# EAGLE design waga_can (EAGLE 7.7.0)

## Sheet 1 of 2
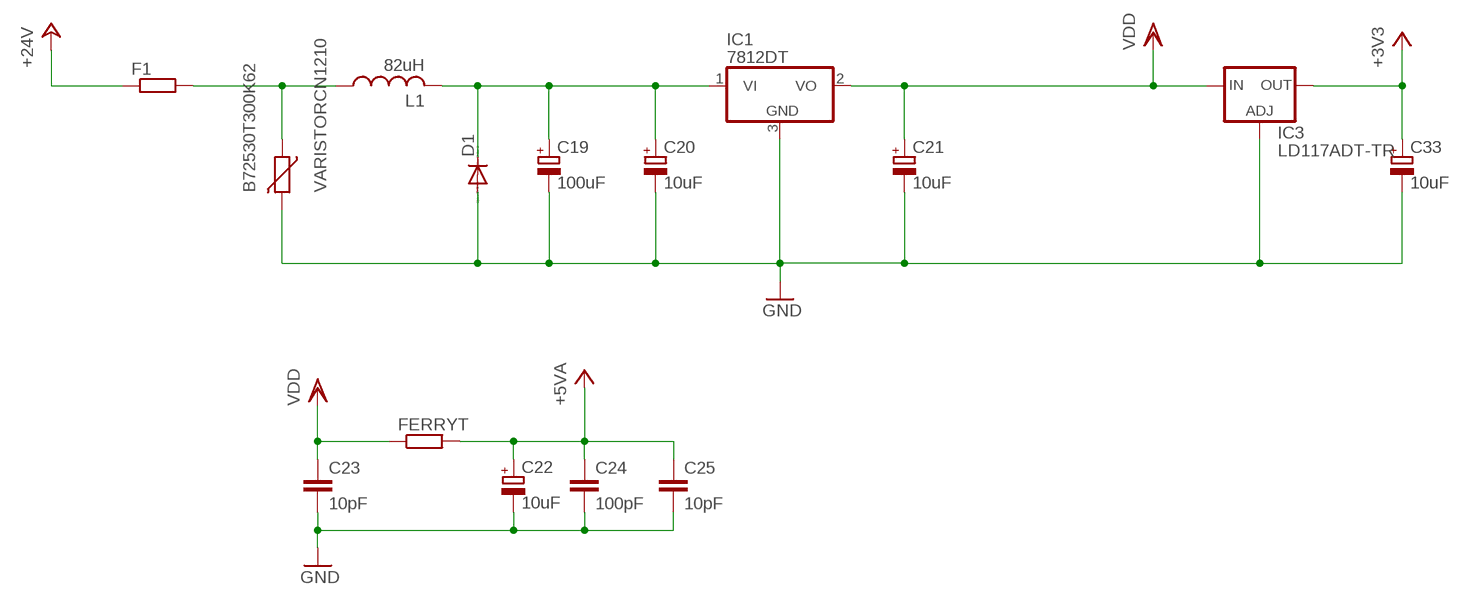
[diagram p0: schematic, sheet 1]

### Parts
B72530T300K62  VARISTORCN1210  [CT/CN1210]
C19  100uF  CPOL-EU153CLV-0810  [153CLV-0810]
C20  10uF  CPOL-EU153CLV-0605  [153CLV-0605]
C21  10uF  CPOL-EU153CLV-0605  [153CLV-0605]
C22  10uF  CPOL-EU153CLV-0605  [153CLV-0605]
C23  10pF  C-EUC0805  [C0805]
C24  100pF  C-EUC0805  [C0805]
C25  10pF  C-EUC0805  [C0805]
C33  10uF  CPOL-EU153CLV-0605  [153CLV-0605]
D1  DIODE-SMB  [SMB]
F1  R-EU_1812X7R  [1812X7R]
FERRYT  R-EU_M0805  [M0805]
IC1  7812DT  [TO252]
IC3  LD117ADT-TR  [DPACK]
L1  82uH  L-USL4532P  [L4532P]

### Nets
+3V3: C33.+ IC3.4(OUT) ; also sheet 2
+5V: C22.+ C24.1 C25.1 FERRYT.2 ; supply symbol labelled +5VA ; also sheet 2
+24V: F1.1 ; also sheet 2
GND: B72530T300K62.2 C19.- C20.- C21.- C22.- C23.2 C24.2 C25.2 C33.- D1.A IC1.3(GND) IC3.1(ADJ) ; also sheet 2
N$1: C19.+ C20.+ D1.C IC1.1(VI) L1.2
N$2: B72530T300K62.1 F1.2 L1.1
VDD: C21.+ C23.1 FERRYT.1 IC1.2(VO) IC3.3(IN)

## Sheet 2 of 2
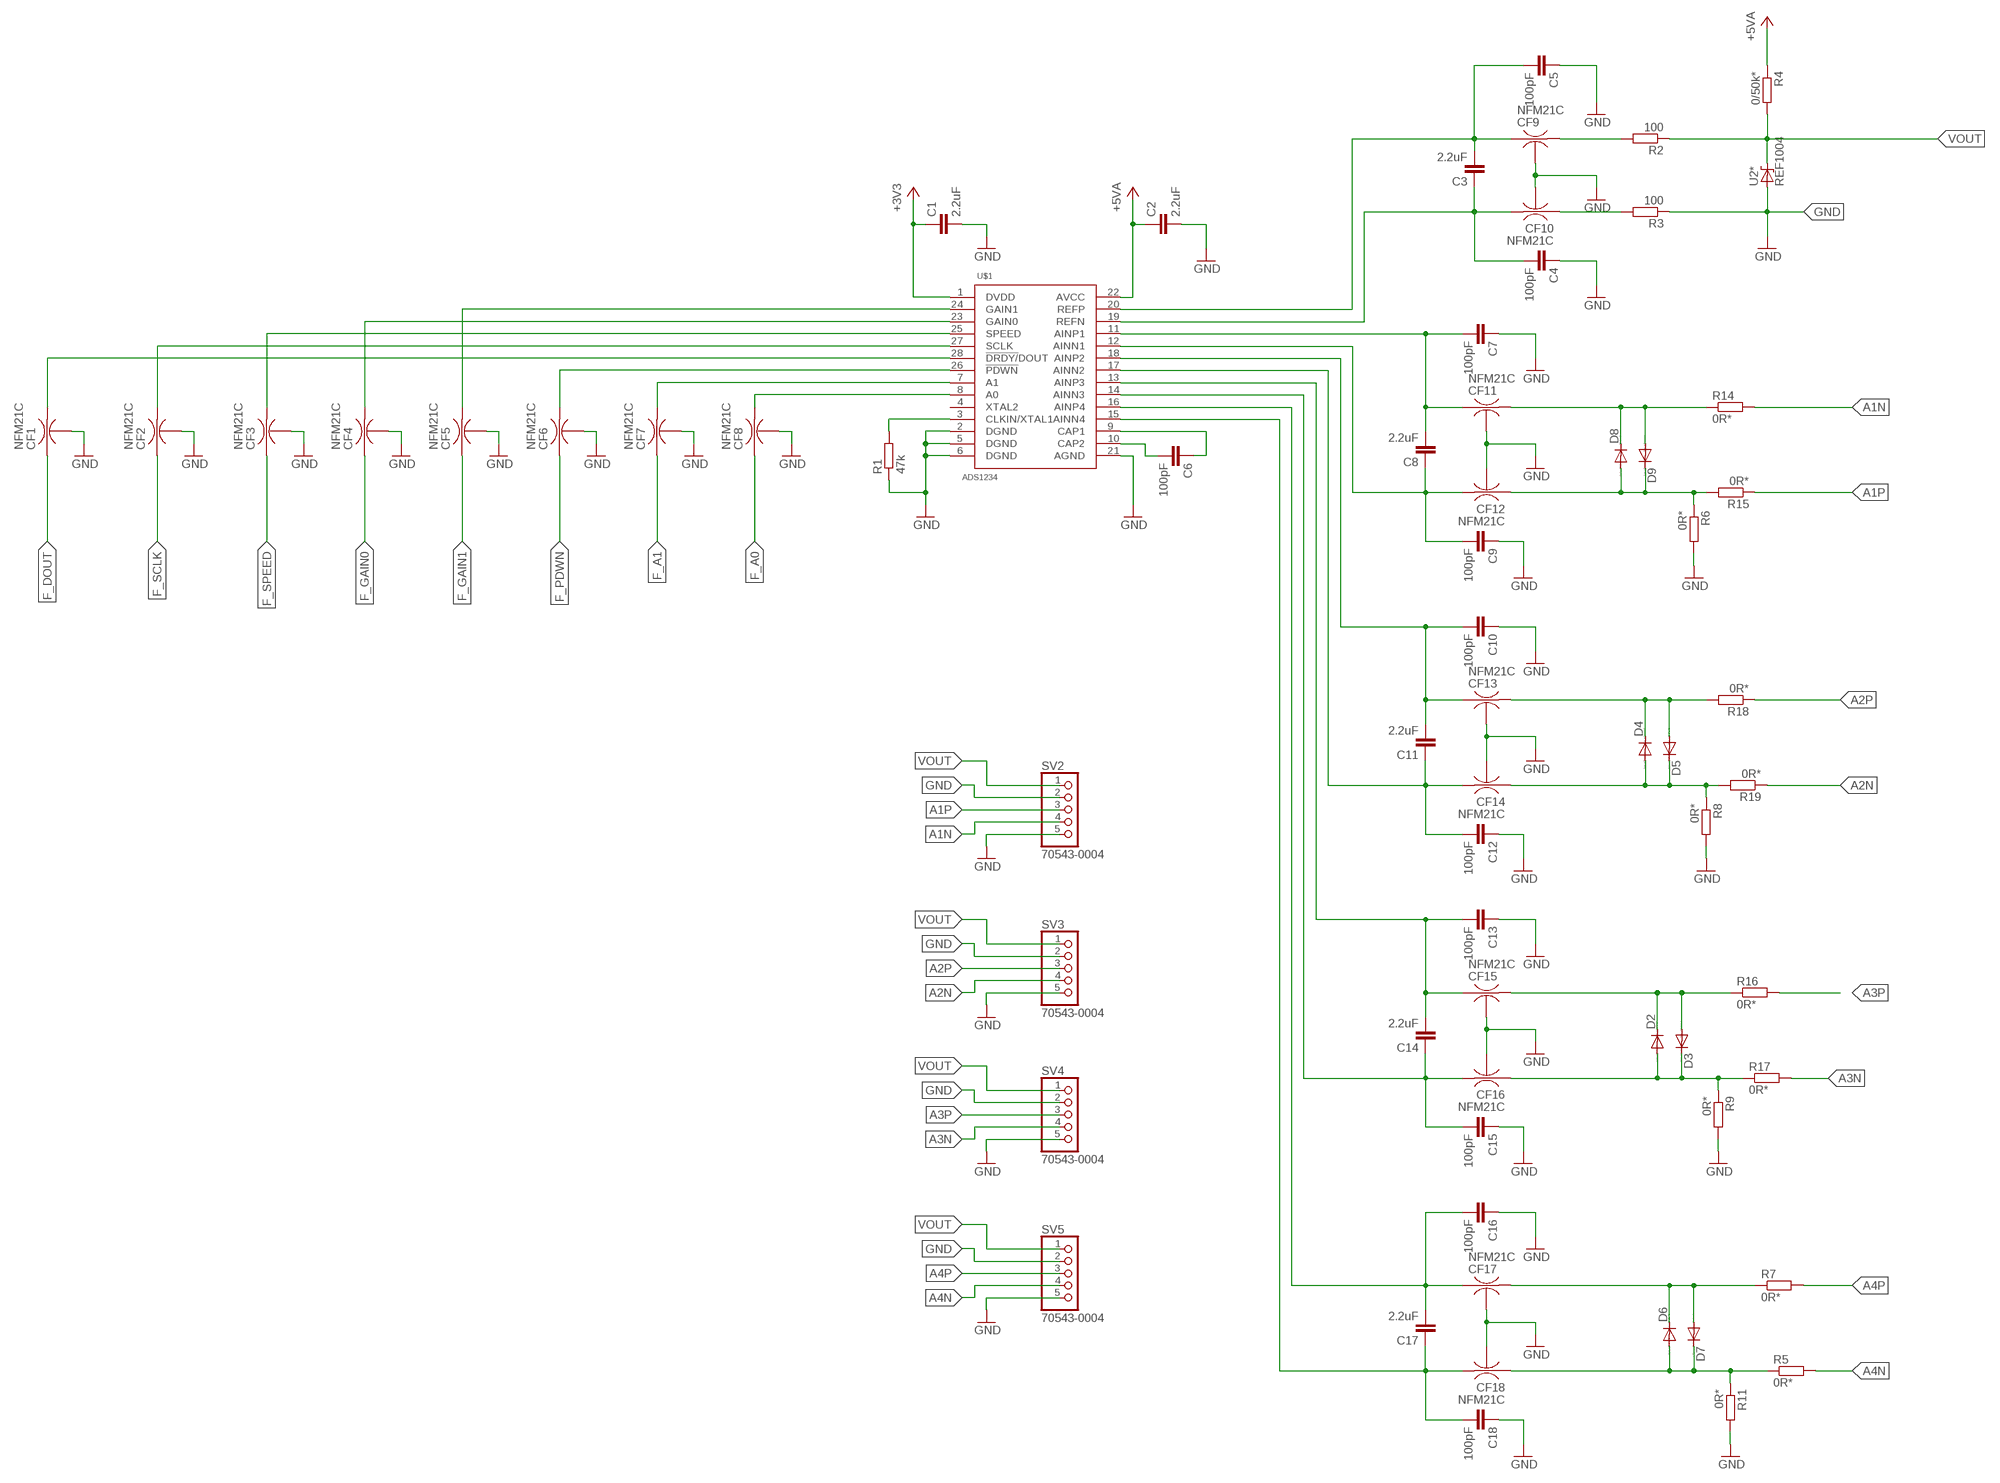
[diagram p1: schematic, sheet 2, part 1 of 2]
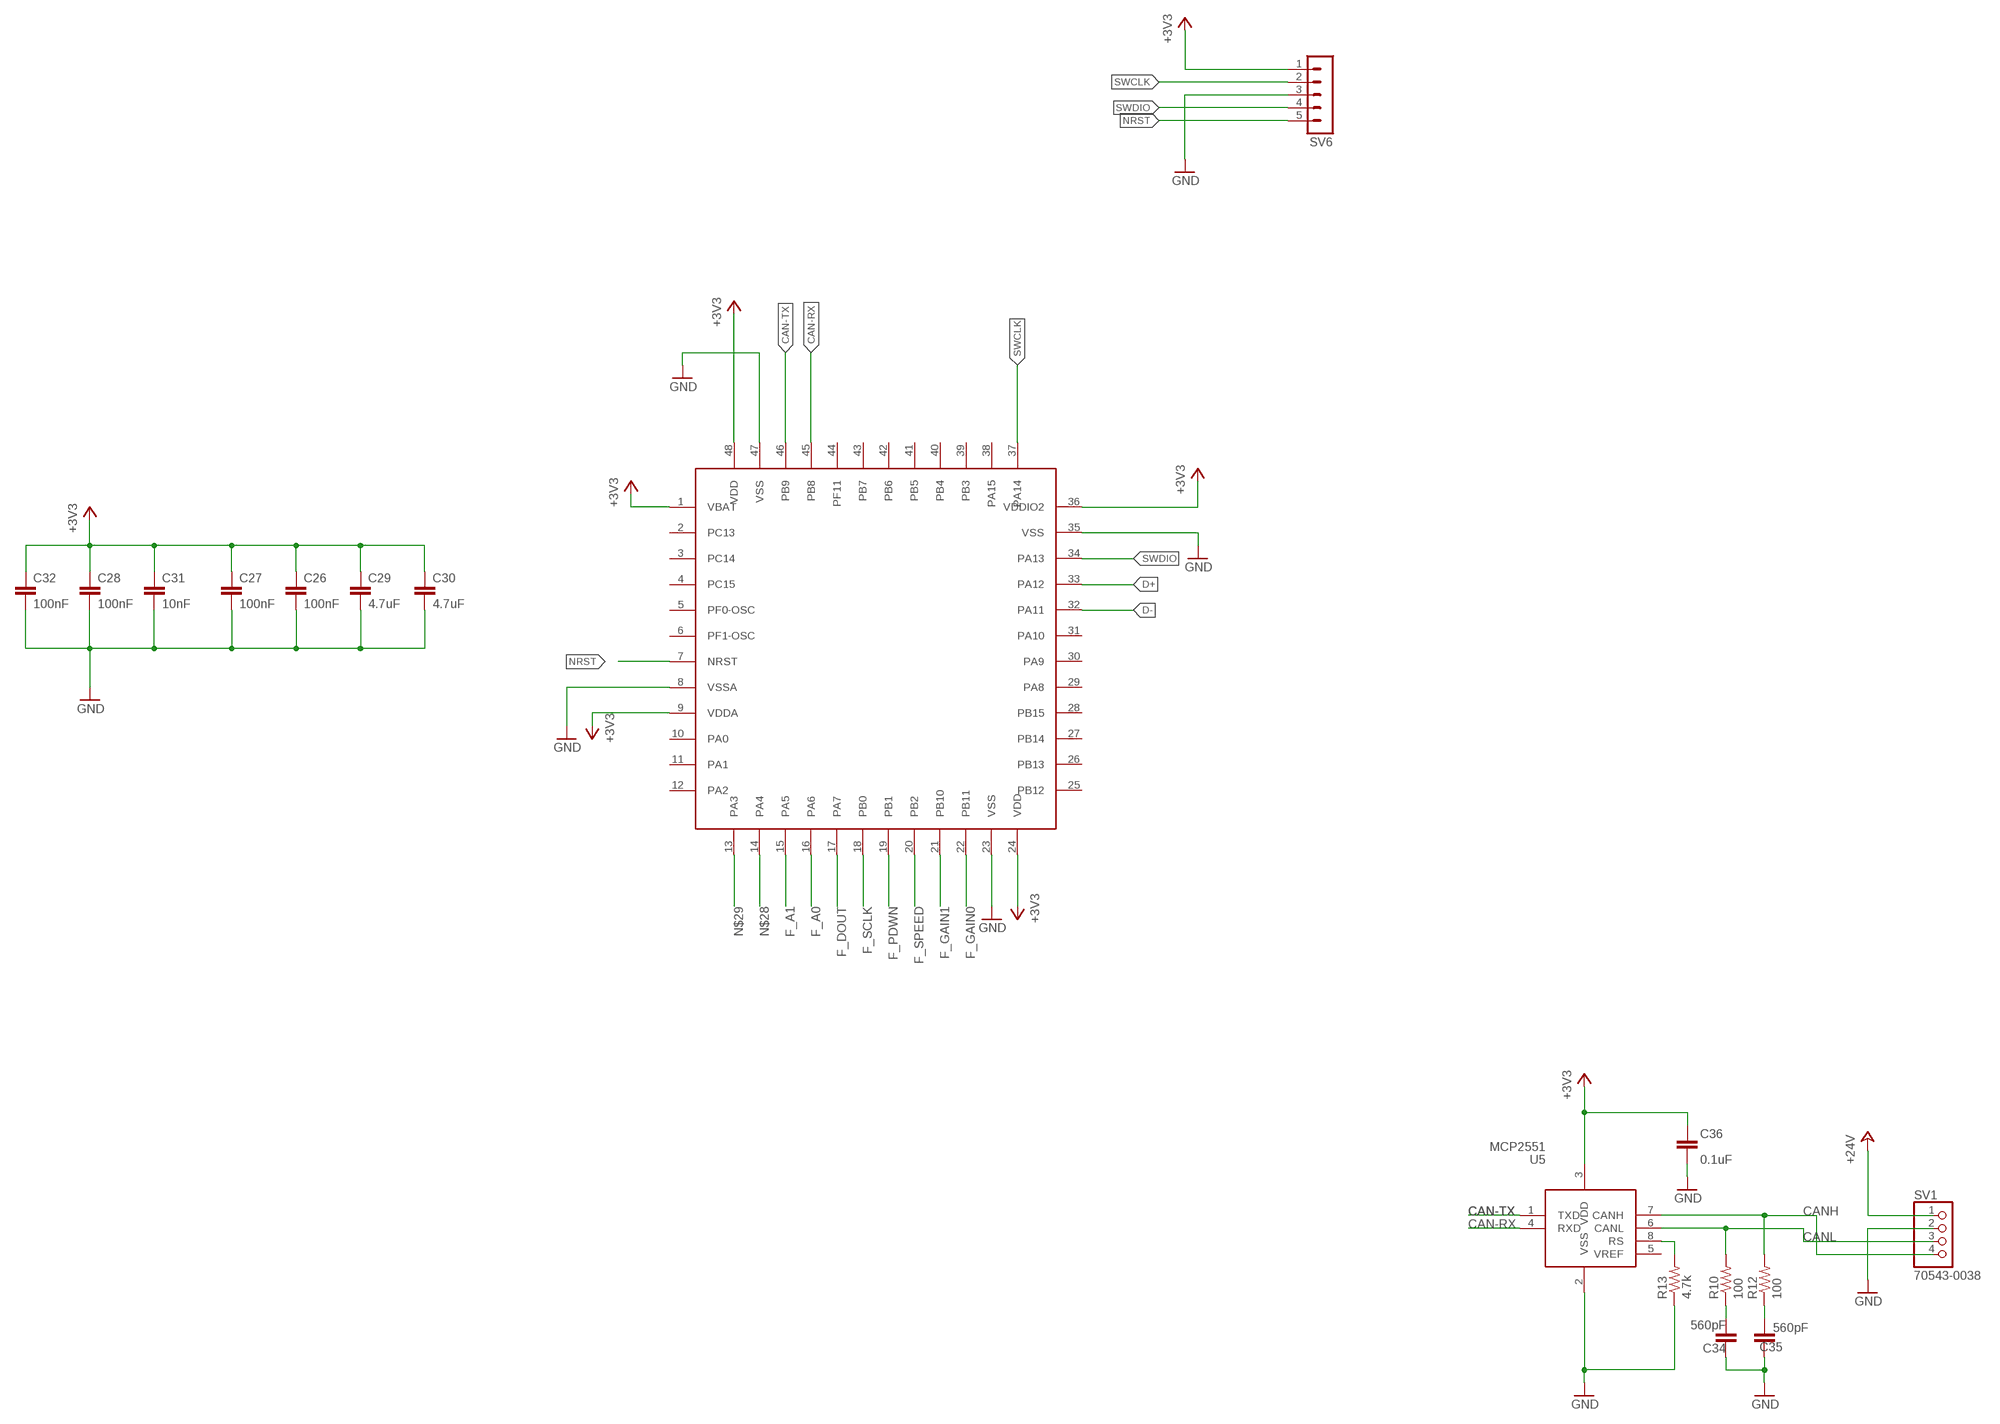
[diagram p2: schematic, sheet 2, part 2 of 2]

### Parts
C1  2.2uF  C-EUC0805K  [C0805K]
C2  2.2uF  C-EUC0805K  [C0805K]
C3  2.2uF  C-EUC0805K  [C0805K]
C4  100pF  C-EUC0805K  [C0805K]
C5  100pF  C-EUC0805K  [C0805K]
C6  100pF  C-EUC0805K  [C0805K]
C7  100pF  C-EUC0805K  [C0805K]
C8  2.2uF  C-EUC0805K  [C0805K]
C9  100pF  C-EUC0805K  [C0805K]
C10  100pF  C-EUC0805K  [C0805K]
C11  2.2uF  C-EUC0805K  [C0805K]
C12  100pF  C-EUC0805K  [C0805K]
C13  100pF  C-EUC0805K  [C0805K]
C14  2.2uF  C-EUC0805K  [C0805K]
C15  100pF  C-EUC0805K  [C0805K]
C16  100pF  C-EUC0805K  [C0805K]
C17  2.2uF  C-EUC0805K  [C0805K]
C18  100pF  C-EUC0805K  [C0805K]
C26  100nF  C-EUC0603  [C0603]
C27  100nF  C-EUC0603  [C0603]
C28  100nF  C-EUC0603  [C0603]
C29  4.7uF  C-EUC0603  [C0603]
C30  4.7uF  C-EUC0603  [C0603]
C31  10nF  C-EUC0603  [C0603]
C32  100nF  C-EUC0603  [C0603]
C34  560pF  CAP0603-CAP  [0603-CAP]
C35  560pF  CAP0603-CAP  [0603-CAP]
C36  0.1uF  CAP0603-CAP  [0603-CAP]
CF1  NFM21C  [NFM21C]
CF2  NFM21C  [NFM21C]
CF3  NFM21C  [NFM21C]
CF4  NFM21C  [NFM21C]
CF5  NFM21C  [NFM21C]
CF6  NFM21C  [NFM21C]
CF7  NFM21C  [NFM21C]
CF8  NFM21C  [NFM21C]
CF9  NFM21C  [NFM21C]
CF10  NFM21C  [NFM21C]
CF11  NFM21C  [NFM21C]
CF12  NFM21C  [NFM21C]
CF13  NFM21C  [NFM21C]
CF14  NFM21C  [NFM21C]
CF15  NFM21C  [NFM21C]
CF16  NFM21C  [NFM21C]
CF17  NFM21C  [NFM21C]
CF18  NFM21C  [NFM21C]
D2  DIODE-MICROMELF-W  [MICROMELF-W]
D3  DIODE-MICROMELF-W  [MICROMELF-W]
D4  DIODE-MICROMELF-W  [MICROMELF-W]
D5  DIODE-MICROMELF-W  [MICROMELF-W]
D6  DIODE-MICROMELF-W  [MICROMELF-W]
D7  DIODE-MICROMELF-W  [MICROMELF-W]
D8  DIODE-MICROMELF-W  [MICROMELF-W]
D9  DIODE-MICROMELF-W  [MICROMELF-W]
R1  47k  R-EU_R0805  [R0805]
R2  100  R-EU_R0805  [R0805]
R3  100  R-EU_R0805  [R0805]
R4  0/50k*  R-EU_R0805  [R0805]
R5  0R*  R-EU_R0603  [R0603]
R6  0R*  R-EU_R0603  [R0603]
R7  0R*  R-EU_R0603  [R0603]
R8  0R*  R-EU_R0603  [R0603]
R9  0R*  R-EU_R0603  [R0603]
R10  100  RESISTOR0603-RES  [0603-RES]
R11  0R*  R-EU_R0603  [R0603]
R12  100  RESISTOR0603-RES  [0603-RES]
R13  4.7k  RESISTOR0603-RES  [0603-RES]
R14  0R*  R-EU_R0603  [R0603]
R15  0R*  R-EU_R0603  [R0603]
R16  0R*  R-EU_R0603  [R0603]
R17  0R*  R-EU_R0603  [R0603]
R18  0R*  R-EU_R0603  [R0603]
R19  0R*  R-EU_R0603  [R0603]
SV1  70543-0038  [70543-0038]
SV2  70543-0004  [70543-0004]
SV3  70543-0004  [70543-0004]
SV4  70543-0004  [70543-0004]
SV5  70543-0004  [70543-0004]
SV6  MA05-1  [MA05-1]
U2*  REF1004  [SO8]
U5  MCP2551  [SO-08M]
U$1  ADS1234  [TSSOP-28]
U$2  STM32F42C6T6  [LQFP48]

### Nets
+3V3: C1.1 C26.1 C27.1 C28.1 C29.1 C30.1 C31.1 C32.1 C36.2 SV6.1 U5.3(VDD) U$1.1(DVDD) U$2.1(VBAT) U$2.9(VDDA) U$2.24(VDD) U$2.36(VDDIO2) U$2.48(VDD) ; also sheet 1
+5V: C2.1 R4.1 U$1.22(AVCC) ; supply symbol labelled +5VA ; also sheet 1
+24V: SV1.1 ; also sheet 1
A0: CF8.3 U$1.8(A0)
A1: CF6.3 U$1.26(!PDWN)
A1N: R14.2 SV2.4
A1P: R15.1 SV2.3
A2N: R19.1 SV3.4
A2P: R18.1 SV3.3
A3N: R17.2 SV4.4
A3P: R16.2 SV4.3
A4N: R5.2 SV5.4
A4P: R7.2 SV5.3
CAN-RX: U5.4(RXD) U$2.45(PB8)
CAN-TX: U5.1(TXD) U$2.46(PB9)
CANH: R12.2 SV1.4 U5.7(CANH)
CANL: R10.2 SV1.3 U5.6(CANL)
D+: U$2.33(PA12)
D-: U$2.32(PA11)
DOUT: CF1.3 U$1.28(!DRDY/!DOUT)
F_A0: CF8.1 U$2.16(PA6)
F_A1: CF7.1 U$2.15(PA5)
F_DOUT: CF1.1 U$2.17(PA7)
F_GAIN0: CF4.1 U$2.22(PB11)
F_GAIN1: CF5.1 U$2.21(PB10)
F_PDWN: CF6.1 U$2.19(PB1)
F_SCLK: CF2.1 U$2.18(PB0)
F_SPEED: CF3.1 U$2.20(PB2)
GAIN0: CF4.3 U$1.23(GAIN0)
GAIN1: CF5.3 U$1.24(GAIN1)
GND: C1.2 C2.2 C4.1 C5.1 C7.1 C9.1 C10.1 C12.1 C13.1 C15.1 C16.1 C18.1 C26.2 C27.2 C28.2 C29.2 C30.2 C31.2 C32.2 C34.1 C35.1 C36.1 CF1.2@1 CF1.2@2 CF2.2@1 CF2.2@2 CF3.2@1 CF3.2@2 CF4.2@1 CF4.2@2 CF5.2@1 CF5.2@2 CF6.2@1 CF6.2@2 CF7.2@1 CF7.2@2 CF8.2@1 CF8.2@2 CF9.2@1 CF9.2@2 CF10.2@1 CF10.2@2 CF11.2@1 CF11.2@2 CF12.2@1 CF12.2@2 CF13.2@1 CF13.2@2 CF14.2@1 CF14.2@2 CF15.2@1 CF15.2@2 CF16.2@1 CF16.2@2 CF17.2@1 CF17.2@2 CF18.2@1 CF18.2@2 R1.1 R3.1 R6.2 R8.2 R9.2 R11.2 R13.1 SV1.2 SV2.2 SV2.5 SV3.2 SV3.5 SV4.2 SV4.5 SV5.2 SV5.5 SV6.3 U2*.4(A) U5.2(VSS) U$1.2(DGND) U$1.5(DGND) U$1.6(DGND) U$1.21(AGND) U$2.8(VSSA) U$2.23(VSS) U$2.35(VSS) U$2.47(VSS) ; also sheet 1
N$3: CF15.3 D2.C D3.A R16.1
N$4: CF16.1 D2.A D3.C R9.1 R17.1
N$5: C34.2 R10.1
N$7: CF7.3 U$1.7(A1)
N$9: R1.2 U$1.3(CLKIN/XTAL1)
N$10: CF18.1 D6.A D7.C R5.1 R11.1
N$11: C3.2 C5.2 CF9.1 U$1.20(REFP)
N$12: C3.1 C4.2 CF10.3 U$1.19(REFN)
N$13: CF17.3 D6.C D7.A R7.1
N$14: C14.1 C15.2 CF16.3 U$1.14(AINN3)
N$15: CF9.3 R2.2
N$16: CF10.1 R3.2
N$17: C6.2 U$1.10(CAP2)
N$18: C6.1 U$1.9(CAP1)
N$19: C35.2 R12.1
N$21: C7.2 C8.2 CF11.1 U$1.11(AINP1)
N$22: C8.1 C9.2 CF12.3 U$1.12(AINN1)
N$23: C10.2 C11.2 CF13.1 U$1.18(AINP2)
N$24: C11.1 C12.2 CF14.3 U$1.17(AINN2)
N$25: R13.2 U5.8(RS)
N$27: C13.2 C14.2 CF15.1 U$1.13(AINP3)
N$28: U$2.14(PA4)
N$29: U$2.13(PA3)
N$30: CF14.1 D4.A D5.C R8.1 R19.2
N$31: CF13.3 D4.C D5.A R18.2
N$32: CF11.3 D8.C D9.A R14.1
N$33: CF12.1 D8.A D9.C R6.1 R15.2
N$35: C16.2 C17.2 CF17.1 U$1.16(AINP4)
N$37: C17.1 C18.2 CF18.3 U$1.15(AINN4)
NRST: SV6.5 U$2.7(NRST)
SCLK: CF2.3 U$1.27(SCLK)
SPEED: CF3.3 U$1.25(SPEED)
SWCLK: SV6.2 U$2.37(PA14)
SWDIO: SV6.4 U$2.34(PA13)
VOUT: R2.1 R4.2 SV2.1 SV3.1 SV4.1 SV5.1 U2*.8(C)
Unconnected: U5.5(VREF) U$1.4(XTAL2) U$2.2(PC13) U$2.3(PC14) U$2.4(PC15) U$2.5(PF0-OSC) U$2.6(PF1-OSC) U$2.10(PA0) U$2.11(PA1) U$2.12(PA2) U$2.25(PB12) U$2.26(PB13) U$2.27(PB14) U$2.28(PB15) U$2.29(PA8) U$2.30(PA9) U$2.31(PA10) U$2.38(PA15) U$2.39(PB3) U$2.40(PB4) U$2.41(PB5) U$2.42(PB6) U$2.43(PB7) U$2.44(PF11)

## Library data of the parts
B72530T300K62 = varistor:VARISTOR: VARISTOR
C1-C18 C23-C32 = rcl:C-EU: CAPACITOR, European symbol
C19-C22 C33 = rcl:CPOL-EU: POLARIZED CAPACITOR, European symbol
C34-C36 = SparkFun:CAP: Capacitor Standard 0603 ceramic capacitor, and 0.1" leaded capacitor.
CF1-CF18 = murata-filter:NFM: EMIFIL(R) (Capacitor type) Single Circuit Type for Signal Lines Source: http://search.murata.co.jp/Ceramy/image/img/PDF/ENG/L0111S0109NFM3DC.pdf; MPN: NFM21CC102R1H3D; OC_FARNELL: 1828795; OC_NEWARK: 84R0165
D1-D9 = diode:DIODE-: DIODE
F1 FERRYT R1-R9 R11 R14-R19 = rcl:R-EU_: RESISTOR, European symbol
IC1 = linear:78*: Positive VOLTAGE REGULATOR Source: http://cache.national.com/ds/LM/LM78L05.pdf http://www.fairchildsemi.com/ds/LM/LM7805.pdf
IC3 = v-reg:LD117A?*: Low drop fixed and adjustable positive voltage regulators 1 A Source: http://www.st.com/stonline/products/literature/ds/7194/ld1117axx.pdf
L1 = rcl:L-US: INDUCTOR, American symbol
R10 R12 R13 = SparkFun:RESISTOR: Resistor Basic schematic elements and footprints for 0603, 1206, and PTH resistors.
SV1 = molex-con:70543-0038
SV2-SV5 = molex-con:70543-0004
SV6 = con-lstb:MA05-1: PIN HEADER; OC_FARNELL: unknown; OC_NEWARK: unknown
U2* = ti_ref:REF1004
U5 = skpang_lib:MCP2551
U$1 = TI-ads1234:ADS1234
U$2 = stm32f0:STM32F42C6T6

## Board
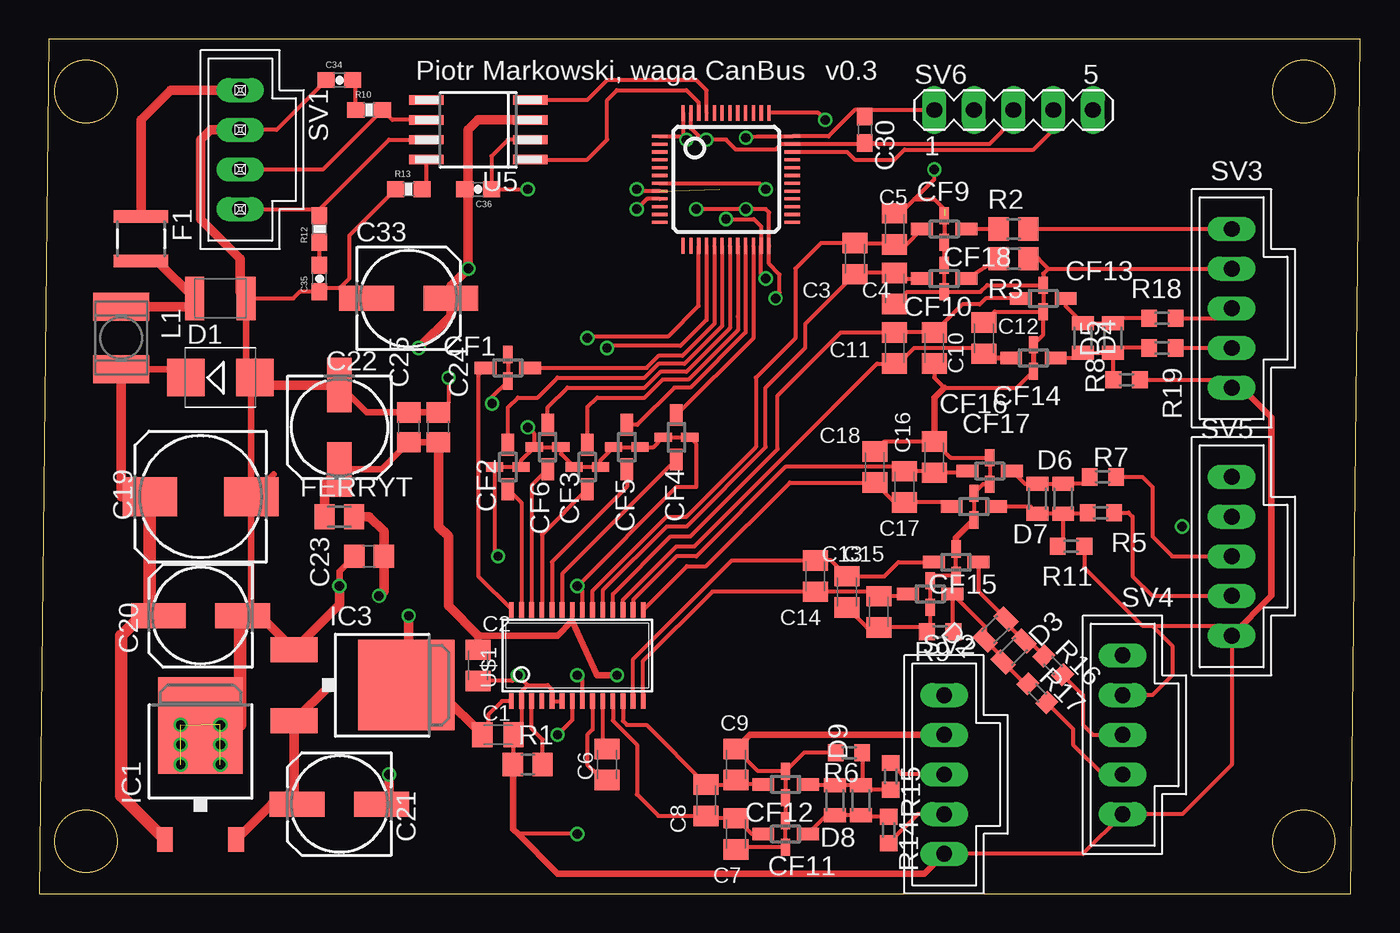
[diagram p3: board, top side]
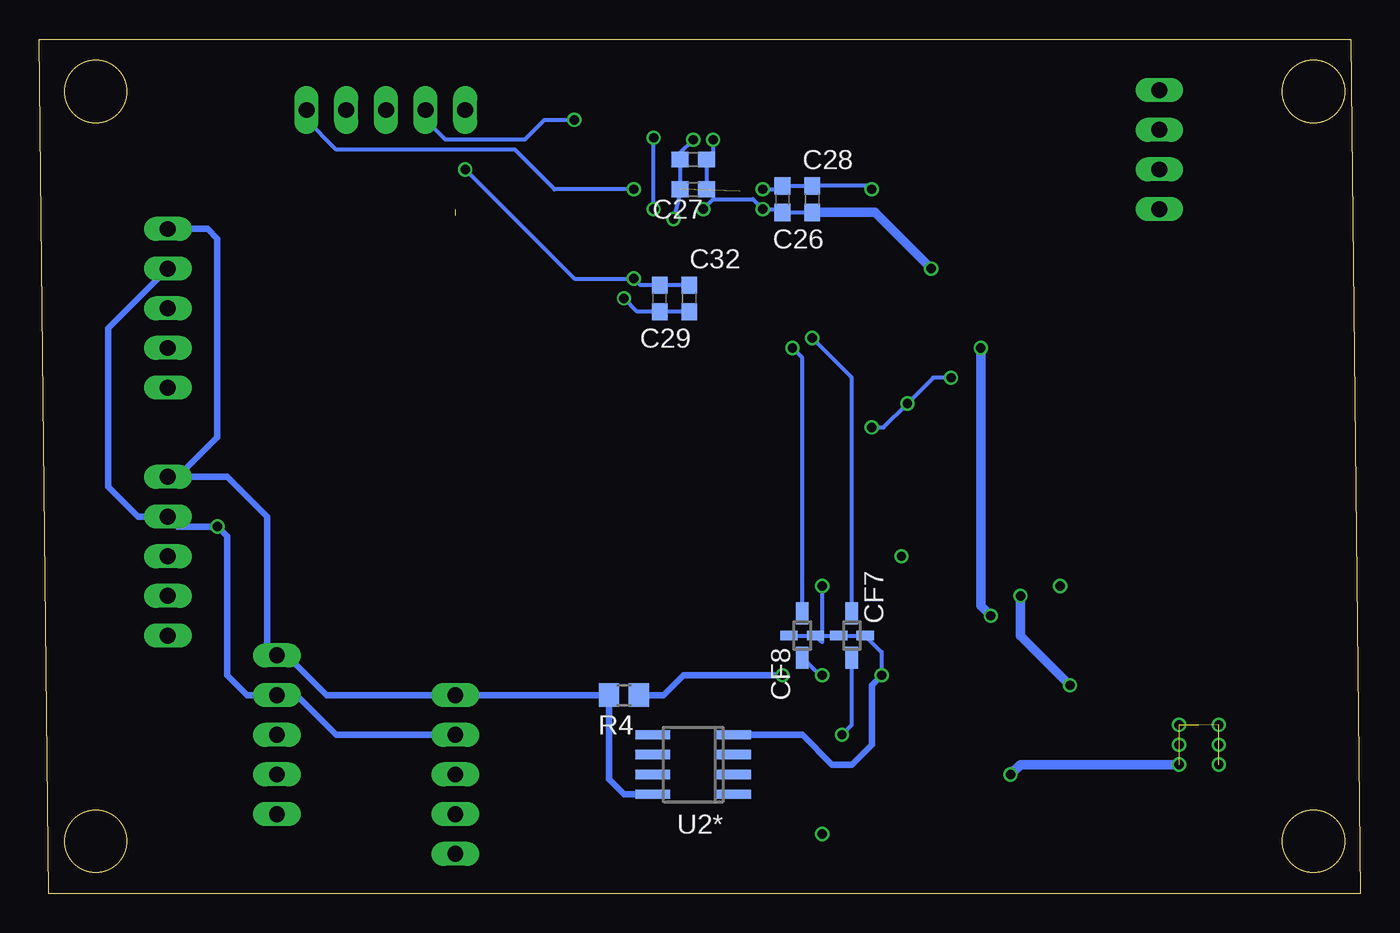
[diagram p4: board, bottom side, seen from below]

Size 84.64 x 54.73 mm. Coordinates in mm from the lower left corner, seen from the top.
Outline: 84.63,54.73 0.63,54.73 0,0 84,0 84.63,54.73
Outline: circle at 3,3.37 radius 2
Outline: circle at 81,51.37 radius 2
Outline: circle at 3,51.37 radius 2
Outline: circle at 81,3.37 radius 2
Copper layers (1*16): Top 0.035mm / dielectric 1.5mm / Bottom 0.035mm
Design rules "NOA Eagle Rule 2016-06-12": minimum track width 6mil, minimum drill 0.3mm, track to track 6mil, track to pad 6mil, pad to pad 6mil, via to via 6mil, smd to smd 0mil, copper to edge 0.4mm, drill to drill 10mil, minimum pad ring 10mil, minimum via ring 6mil, stop-mask expansion 2mil, vias tented up to drill 25mil, thermal gap 10mil

### Footprints (pad centres in the part's own frame; a part is rotated, then mirrored left to right if it is on the bottom)
CT/CN1210 = smd 1.2 x 2.8: 1 -1.65,0; 2 1.65,0
C0805K = smd 1.3 x 1.6: 1 -1,0; 2 1,0
153CLV-0810 = smd 3.5 x 2.5: + 3.25,0; - -3.25,0
153CLV-0605 = smd 3.5 x 1.6: + 2.7,0; - -2.7,0
C0805 = smd 1.3 x 1.5: 1 -0.95,0; 2 0.95,0
C0603 = smd 1.1 x 1: 1 -0.85,0; 2 0.85,0
0603-CAP = smd 1.1 x 1: 1 -0.85,0; 2 0.85,0
NFM21C = smd 1.4 x 0.8: 1 -1.425,0; 3 1.425,0 | smd 0.6 x 1.1: 2@1 0,-0.85; 2@2 0,0.85
SMB = smd 2.4 x 2.4: A 2.2,0; C -2.2,0
MICROMELF-W = smd 0.9 x 1.4: A 0.95,0; C -0.95,0
1812X7R = smd 0.8 x 3.5: 1 -1.425,0; 2 1.425,0
M0805 = smd 1.3 x 1.6: 1 -0.95,0; 2 0.95,0
TO252 = smd 1 x 1.6: 1 -2.28,-4.8; 2 2.28,-4.8 | smd 5.4 x 6.2: 3 0,2.5
DPACK = smd 1.6 x 3: 1 -2.28,-4.8; 3 2.28,-4.8 | smd 5.8 x 6.2: 4 0,2.38
L4532P = smd 1.8 x 3.6: 1 -2,0; 2 2,0
R0805 = smd 1.3 x 1.5: 1 -0.95,0; 2 0.95,0
R0603 = smd 1 x 1.1: 1 -0.85,0; 2 0.85,0
0603-RES = smd 1.1 x 1: 1 -0.85,0; 2 0.85,0
70543-0038 = drill 1.016 long: 1 -3.81,0; 2 -1.27,0; 3 1.27,0; 4 3.81,0
70543-0004 = drill 1.016 long: 1 -5.08,0; 2 -2.54,0; 3 0,0; 4 2.54,0; 5 5.08,0
MA05-1 = drill 1.016 long: 1 -5.08,0; 2 -2.54,0; 3 0,0; 4 2.54,0; 5 5.08,0
SO8 = smd 0.6 x 2.2: 1 -1.905,-2.6; 2 -0.635,-2.6; 3 0.635,-2.6; 4 1.905,-2.6; 5 1.905,2.6; 6 0.635,2.6; 7 -0.635,2.6; 8 -1.905,2.6
SO-08M = smd 0.6 x 2.2: 1 -1.905,-3.33; 2 -0.635,-3.33; 3 0.635,-3.33; 4 1.905,-3.33; 5 1.905,3.33; 6 0.635,3.33; 7 -0.635,3.33; 8 -1.905,3.33
TSSOP-28 = smd 0.305 x 0.991: 1 -4.225,-2.918; 2 -3.575,-2.918; 3 -2.925,-2.918; 4 -2.275,-2.918; 5 -1.625,-2.918; 6 -0.975,-2.918; 7 -0.325,-2.918; 8 0.325,-2.918; 9 0.975,-2.918; 10 1.625,-2.918; 11 2.275,-2.918; 12 2.925,-2.918; 13 3.575,-2.918; 14 4.225,-2.918; 15 4.225,2.918; 16 3.575,2.918; 17 2.925,2.918; 18 2.275,2.918; 19 1.625,2.918; 20 0.975,2.918; 21 0.325,2.918; 22 -0.325,2.918; 23 -0.975,2.918; 24 -1.625,2.918; 25 -2.275,2.918; 26 -2.925,2.918; 27 -3.575,2.918; 28 -4.225,2.918
LQFP48 = smd 0.2 x 1: 1 -2.75,-4.25; 2 -2.25,-4.25; 3 -1.75,-4.25; 4 -1.25,-4.25; 5 -0.75,-4.25; 6 -0.25,-4.25; 7 0.25,-4.25; 8 0.75,-4.25; 9 1.25,-4.25; 10 1.75,-4.25; 11 2.25,-4.25; 12 2.75,-4.25; 25 2.75,4.25; 26 2.25,4.25; 27 1.75,4.25; 28 1.25,4.25; 29 0.75,4.25; 30 0.25,4.25; 31 -0.25,4.25; 32 -0.75,4.25; 33 -1.25,4.25; 34 -1.75,4.25; 35 -2.25,4.25; 36 -2.75,4.25 | smd 1 x 0.2: 13 4.25,-2.75; 14 4.25,-2.25; 15 4.25,-1.75; 16 4.25,-1.25; 17 4.25,-0.75; 18 4.25,-0.25; 19 4.25,0.25; 20 4.25,0.75; 21 4.25,1.25; 22 4.25,1.75; 23 4.25,2.25; 24 4.25,2.75; 37 -4.25,2.75; 38 -4.25,2.25; 39 -4.25,1.75; 40 -4.25,1.25; 41 -4.25,0.75; 42 -4.25,0.25; 43 -4.25,-0.25; 44 -4.25,-0.75; 45 -4.25,-1.25; 46 -4.25,-1.75; 47 -4.25,-2.25; 48 -4.25,-2.75

### Placement (x,y rotation side)
B72530T300K62  11.62,38.13 0 top
C1  29.4,10.19 0 top
C2  28.13,14.63 270 top
C3  52.26,40.67 90 top
C4  54.8,38.76 90 top
C5  54.8,42.57 270 top
C6  36.38,8.28 90 top
C7  44.64,3.84 90 top
C8  42.73,5.99 270 top
C9  44.64,8.28 270 top
C10  57.34,34.95 90 top
C11  54.8,34.95 90 top
C12  60.51,35.59 270 top
C13  51.75,19.33 90 top
C14  49.72,20.35 90 top
C15  53.78,18.06 90 top
C16  57.34,27.97 270 top
C17  55.43,26.06 90 top
C18  53.53,27.33 270 top
C19  10.35,25.43 180 top
C20  10.35,17.81 180 top
C21  19.24,5.74 180 top
C22  19.24,29.87 270 top
C23  21.14,21.62 180 top
C24  25.59,29.87 90 top
C25  23.68,29.87 90 top
C26  37.02,44.48 90 bottom
C27  42.73,45.11 180 bottom
C28  35.11,44.48 90 bottom
C29  44.89,38.13 90 bottom
C30  52.89,48.92 270 top
C31  42.73,47.02 180 bottom
C32  42.99,38.13 90 bottom
C33  23.68,38.13 0 top
C34  19.24,52.1 0 top
C35  17.97,39.4 90 top
C36  28.13,45.11 180 top
CF1  30.03,33.68 180 top
CF2  30.03,27.33 270 top
CF3  35.11,27.33 270 top
CF4  40.83,29.24 270 top
CF5  37.65,28.6 270 top
CF6  32.57,28.6 270 top
CF7  32.57,16.54 270 bottom
CF8  35.75,16.54 270 bottom
CF9  57.97,42.57 0 top
CF10  57.97,39.4 180 top
CF11  47.81,3.84 0 top
CF12  47.81,7.01 180 top
CF13  64.32,38.13 0 top
CF14  63.69,34.32 180 top
CF15  58.73,21.23 0 top
CF16  57.08,19.2 180 top
CF17  60.89,27.08 0 top
CF18  59.88,24.79 180 top
D1  11.62,33.05 0 top
D2  61.27,16.92 225 top
D3  62.42,15.52 45 top
D4  66.86,35.59 270 top
D5  68.77,35.59 90 top
D6  63.94,25.3 270 top
D7  65.59,25.3 90 top
D8  50.99,5.99 90 top
D9  52.64,5.99 270 top
F1  6.54,41.94 270 top
FERRYT  19.24,24.16 180 top
IC1  10.35,8.28 0 top
IC3  21.14,13.36 270 top
L1  5.27,35.59 270 top
R1  31.3,8.28 0 top
R2  62.42,42.57 180 top
R3  62.42,40.67 180 top
R4  47.18,12.73 180 bottom
R5  68,24.41 0 top
R6  51.88,9.04 180 top
R7  68.13,26.7 0 top
R8  69.66,32.92 0 top
R9  57.72,16.79 180 top
R10  21.14,50.19 0 top
R11  66.1,22.25 0 top
R12  17.97,42.57 90 top
R13  23.68,45.11 0 top
R14  54.42,4.09 270 top
R15  54.54,7.52 270 top
R16  64.96,14.63 315 top
R17  63.94,12.85 315 top
R18  71.94,36.86 180 top
R19  71.94,34.95 180 top
SV1  12.89,47.65 270 top
SV2  57.97,7.65 270 top
SV3  76.39,37.49 270 top
SV4  69.4,10.19 270 top
SV5  76.39,21.62 270 top
SV6  62.42,50.19 0 top
U2*  42.73,8.28 90 bottom
U5  28.13,48.92 90 top
U$1  34.48,15.27 0 top
U$2  44,45.75 270 top

### Tracks (layer width: path | path; a pad name or v marks a point on that pad's centre or on a via)
+3V3  (via drill 0.6)
  Top 0.254: 52.89,50.19 52.26,50.19 50.56,48.5 U$2.36 45.99,48.5 v45.27,48.41 | U$2.9 38.94,44.5 v38.29,43.84 | U$2.48 41.25,48.5 | 41.25,48.5 v41.46,48.29 arc90 41.25,48.5 | v42.1,43.84 v45.27,43.84 46.54,43.84 46.75,43.63 U$2.24 46.75,40.33 47.43,39.65 47.43,38.51 47.18,38.25 v47.18,38.13 | C30.1 52.89,50.19 | U$2.1 41.25,48.5 | U$1.1 29.65,12.35 28.76,11.46 28.76,10.55 C1.1 | 52.89,50.19 SV6.1
  Top 0.61: C1.1 25.86,12.73 23.68,12.73 23.52,12.89 IC3.4 23.68,13.52 v23.68,17.81 | U5.3 28.13,49.56 27.49,48.92 27.49,45.33 | 27.49,45.33 C36.2 | v24.32,34.95 26.38,37.02 C33.+ 26.38,38.92 v27.49,40.03 27.49,45.33
  Bottom 0.254: C32.1 C29.1 46.33,37.28 v47.18,38.13 | v41.46,48.29 41.46,47.44 C31.1 C27.1 41.46,44.69 41.46,44.48 | 41.46,44.48 38.92,44.48 v38.29,43.84 37.23,43.84 C26.1 C28.1 | v42.1,43.84 41.46,44.48 | v45.27,43.84 v45.27,48.41
  Bottom 0.61: v24.32,34.95 24.32,18.44 v23.68,17.81 | C28.1 31.09,43.63 v27.49,40.03
+5V  (via drill 0.6)
  Top 0.254: 34.15,17.48 U$1.22 | C2.1 28.13,16.54
  Top 0.406: 28.13,16.54 33.21,16.54 34.15,17.48 35.73,14 v37.02,14 | C22.+ 21.93,27.17 C25.1 C24.1
  Top 0.61: FERRYT.2 18.29,26.22 C22.+ | 28.13,16.54 26.22,18.44 26.22,22.89 25.59,23.52 C24.1
  Bottom 0.406: v37.02,14 43.37,14 44.64,12.73 R4.1
+24V
  Top 0.61: SV1.1 8.44,51.46 6.54,49.56 F1.1
A0  (via drill 0.6)
  Top 0.254: U$1.8 34.8,13.67 v34.48,14
  Bottom 0.254: v34.48,14 34.63,14 CF8.3
A1
  Top 0.254: CF6.3 31.55,26.16 U$1.26
A1N
  Top 0.254: SV2.4 56.28,5.11 R14.2
A1P
  Top 0.254: SV2.3 55.27,7.65 R15.1
A2N
  Top 0.254: R19.1 SV3.4
A2P
  Top 0.254: R18.1 75.75,36.86 SV3.3
A3N
  Top 0.254: R17.2 66.23,10.57 66.23,9.55 68.13,7.65 SV4.4
A3P
  Top 0.254: R16.2 66.86,12.73 66.86,10.82 67.5,10.19 SV4.3
A4N
  Top 0.254: R5.2 69.78,24.41 70.04,24.16 70.04,20.35 71.31,19.08 SV5.4
A4P
  Top 0.254: R7.2 70.67,26.7 71.31,26.06 71.31,22.89 72.58,21.62 SV5.3
CAN-RX
  Top 0.254: U$2.45 42.75,51.44 42.1,52.1 36.38,52.1 35.11,50.83 U5.4
CAN-TX
  Top 0.254: U5.1 35.11,47.02 36.38,48.29 36.38,50.83 37.02,51.46 41.46,51.46 42.25,50.67 U$2.46
CANH
  Top 0.254: SV1.4 17.55,43.84 R12.2 17.97,43.84 22.41,48.29 U5.7
CANL
  Top 0.254: U5.6 22.63,49.56 R10.2 18.18,46.38 SV1.3
DOUT
  Top 0.254: CF1.3 28.13,33.2 28.13,20.35 30.25,18.22 U$1.28
F_A0  (via drill 0.6)
  Top 0.254: U$2.16 42.75,36.75 41.08,35.08 36.51,35.08 v36.38,34.95
  Bottom 0.254: CF8.1 35.75,34.32 v36.38,34.95
F_A1  (via drill 0.6)
  Top 0.254: v35.11,35.59 35.24,35.71 40.32,35.71 42.25,37.65 U$2.15
  Bottom 0.254: CF7.1 32.57,33.05 v35.11,35.59
F_DOUT
  Top 0.254: 31.3,33.53 CF1.1 38.92,33.68 39.68,34.44 41.21,34.44 43.25,36.49 U$2.17
F_GAIN0
  Top 0.254: 40.98,30.51 CF4.1 45.75,35.59 U$2.22
F_GAIN1
  Top 0.254: 37.81,30.03 CF5.1 38.31,30.03 40.7,32.41 41.72,32.41 45.25,35.95 U$2.21
F_PDWN
  Top 0.254: CF6.1 32.57,31.14 33.84,32.41 38.79,32.41 39.81,33.43 41.46,33.43 44.25,36.22 U$2.19
F_SCLK
  Top 0.254: CF2.1 30.03,31.14 30.67,31.78 31.94,31.78 33.21,33.05 38.79,33.05 39.68,33.93 41.33,33.93 43.75,36.35 U$2.18
F_SPEED
  Top 0.254: CF3.1 35.11,31.14 35.75,31.78 38.79,31.78 39.94,32.92 41.59,32.92 44.76,36.09 44.76,36.96 44.75,36.97 U$2.20
GAIN0
  Top 0.254: CF4.3 33.5,20.49 U$1.23
GAIN1
  Top 0.254: CF5.3 37.65,26.06 32.85,21.26 U$1.24
GND  (via drill 0.6)  (8 unrouted)
  Top 0.254: 31.3,13.36 30.9,12.96 U$1.2 30.9,10.69 C1.2 30.4,8.33 R1.1 | 31.3,13.36 32.57,13.36 32.85,13.08 U$1.5 U$1.6 | CF1.2@1 CF1.2@2 29.02,31.81 v29.02,31.39 | CF6.2@1 30.88,27.76 CF2.2@2 CF2.2@1 29.18,21.62 v29.4,21.62 | CF6.2@1 CF6.2@2 33.42,28.17 CF3.2@1 CF3.2@2 35.96,27.76 CF5.2@1 CF5.2@2 39.34,28.6 CF4.2@1 CF4.2@2 42.1,28.82 42.1,26.06 40.83,26.06 v34.48,19.71 34.8,19.4 U$1.21 | v30.67,14 31.3,13.36 | 30.35,13.68 v30.67,14 | 56.07,44.48 57.34,44.48 57.97,43.84 CF9.2@1 CF10.2@1 CF10.2@2 | C4.1 55.58,38.55 CF10.2@2 | CF14.2@1 64.32,35.8 CF13.2@1 | C12.1 61.2,37.28 CF13.2@1 | 54.7,43.48 C5.1 55.16,43.57 56.07,44.48 | C10.1 57.34,33.05 57.97,32.41 62.63,32.41 CF14.2@2 | v30.67,14 30.3,13.63 C2.2 | B72530T300K62.2 16.28,38.13 16.7,38.55 C35.1 18.18,38.76 19.24,38.76 | 53.53,48 U$2.35 47.52,48 47.18,47.65 44.64,47.65 44,48.29 v42.73,48.29 42.48,48.29 41.75,49.01 U$2.47 | U$2.8 38.4,45 v38.29,45.11 | v44,43.21 45.78,43.21 46.25,42.73 U$2.23 46.25,39.69 v46.54,39.4 | C30.2 53.45,48.07 53.53,48 | C34.1 15.21,48.92 SV1.2 | 19.24,38.76 19.87,39.4 19.87,42.15 R13.1 | v26.22,33.05 26.22,31.46 C24.2 | CF6.2@1 31.72,29.45 v31.3,29.87 | U5.2 30.03,48.29 28.98,47.23 C36.1 v31.3,45.11 | v34.48,3.84 30.67,3.84 | C33.- 19.87,38.13 19.24,38.76 | SV6.3 62.42,49.56 60.86,48 53.53,48 | 64.64,40.03 SV3.2 | R3.1 64.01,40.67 64.64,40.03 | R8.2 75.88,32.92 SV3.5 | C18.1 54.16,28.97 C16.1 58.38,27.93 CF17.2@2 CF17.2@1 60.46,26.23 CF18.2@1 CF18.2@2 | CF15.2@2 CF15.2@1 57.41,20.38 CF16.2@1 CF16.2@2 57.08,17 R9.2 56.6,17.06 C15.1 53.02,17.06 C13.1 | C7.1 44.79,2.99 CF11.2@1 CF11.2@2 CF12.2@2 CF12.2@1 | R6.2 48.99,9.04 CF12.2@1
  Top 0.254: CF12.2@1 46.06,7.86 C9.1 | SV2.5 66.86,2.57 SV4.5 73.21,5.11 76.39,8.28 SV5.5 75.75,17.17 71.31,17.17 | R11.2 66.95,20.89 70.67,17.17 71.31,17.17 | 71.31,17.17 72.58,15.9 72.58,14 71.31,12.73 SV4.2 | CF13.2@2 CF13.2@1 | 64.64,40.03 64.32,39.71 CF13.2@2 | CF10.2@2 60.3,38.55 60.73,38.98 CF13.2@2 | 56.07,44.48 57.34,45.75 v57.34,46.38
  Top 0.305: CF14.2@1 CF14.2@2 | C4.1 54.8,37.49
  Top 0.406: 12.89,38.13 B72530T300K62.2 13.27,33.05 13.6,33.05 | 13.6,33.05 D1.A | C19.- 13.6,33.05 | C19.- 13.6,17.81 C20.- | R1.1 30.35,4.15 30.67,3.84 33.21,1.3 56.7,1.3 SV2.5 | 15.03,26.86 C19.- | C22.- 20.99,30.82 C25.2 C24.2 | v19.24,19.71 19.24,20.66 C23.2 | SV3.5 77.02,32.41 78.93,30.51 78.93,19.08 SV5.5 | C9.1 45.54,10.19 SV2.2 | CF18.2@2 58.73,22.8 CF15.2@2 | 57.97,32.41 57.34,31.78 C16.1
  Top 0.61: SV1.2 10.98,48.92 10.35,48.29 10.35,43.21 12.89,40.67 12.89,38.51 B72530T300K62.2 | C20.- 14.18,17.81 IC3.1 19.24,18.54 v19.24,19.71 | C21.- 22.41,6.22 v22.41,7.65 | C22.- 14.29,32.57 D1.A
  Top 0.813: IC1.3 10.39,10.82 12.89,10.82 12.89,17.1 13.6,17.81
  Bottom 0.254: CF8.2@1 CF8.2@2 | CF8.2@2 CF7.2@1 CF7.2@2 30.67,15.48 v30.67,14 | v34.48,19.71 34.48,16.12 CF8.2@2 | v38.29,45.11 37.23,45.11 C26.2 C28.2 31.52,45.33 v31.3,45.11 | C32.2 C29.2 46.12,38.98 v46.54,39.4 50.35,39.4 v57.34,46.38 | v42.73,48.29 43.58,47.44 C31.2 C27.2 43.58,44.9 v44,43.21 | v31.3,29.87 30.54,29.87 v29.02,31.39 27.36,33.05 v26.22,33.05
  Bottom 0.406: U2*.4 35.75,10.19 33.84,8.28 32.57,8.28 31.3,9.55 31.3,13.36 v30.67,14 | SV3.2 80.2,36.22 80.2,26.06 78.29,24.16 SV5.2 75.75,23.52 v73.21,23.52 72.58,22.89 72.58,14 71.31,12.73 SV4.2 68.13,12.73 65.59,10.19 SV2.2
  Bottom 0.61: v22.41,7.65 21.78,8.28 v11.62,8.28
  other vias: 9.08,8.28 9.08,9.55 9.08,10.82 11.62,9.55 11.62,10.82
N$1
  Top 0.406: D1.C 9.42,33.59 L1.2 | 5.27,25.43 C19.+
  Top 0.61: L1.2 5.27,25.43
  Top 0.813: IC1.1 5.27,6.28 5.27,16.54 6.54,17.81 C20.+ 7.1,18.36 C19.+
N$2
  Top 0.406: 10.35,38.13 B72530T300K62.1 9.97,37.59 | F1.2 7.58,40.51
  Top 0.61: 9.97,37.59 L1.1 | 7.58,40.51 B72530T300K62.1
N$3
  Top 0.254: R16.1 63.4,16.19 D3.A 61.95,17.33 D2.C 60.16,19.38 CF15.3
N$4
  Top 0.254: R17.1 63.14,13.45 D3.C 61.74,15.1 D2.A 60.6,17.11 CF16.1 58.51,16.85 R9.1
N$5
  Top 0.254: R10.1 20.29,51.89 C34.2
N$7  (via drill 0.6)
  Top 0.254: U$1.7 34.15,11.13 v33.21,10.19
  Bottom 0.254: v33.21,10.19 32.57,10.82 CF7.3
N$9
  Top 0.254: U$1.3 31.55,10.57 32.25,9.87 R1.2 31.94,7.97
N$10
  Top 0.254: R5.1 67.09,24.35 D7.C | D7.C D6.A 63.5,24.79 CF18.1 | R11.1 65.59,22.59 D7.C
N$11
  Top 0.254: CF9.1 55.55,41.57 C5.2 54.7,41.67 C3.2 50.08,41.67 48.45,40.03 48.45,35.59 45.91,33.05 45.91,28.6 41.46,24.16 40.19,24.16 35.45,19.42 U$1.20
N$12
  Top 0.254: CF10.3 55.16,39.4 C4.2 52.35,39.76 C3.1 49.08,36.49 49.08,34.95 46.54,32.41 46.54,28.6 41.46,23.52 40.19,23.52 36.1,19.43 U$1.19
N$13
  Top 0.254: CF17.3 63.15,26.25 D6.C D7.A 66.83,26.25 R7.1
N$14
  Top 0.254: CF16.3 55.51,19.06 C15.2 53.78,19.35 C14.1 43.13,19.35 38.67,14.88 38.67,12.38 U$1.14
N$15
  Top 0.254: CF9.3 R2.2
N$16
  Top 0.254: CF10.1 R3.2
N$17
  Top 0.254: U$1.10 36.1,9.56 C6.2
N$18
  Top 0.254: U$1.9 35.45,10.53 35.11,10.19 35.11,8.28 35.75,7.65 36.02,7.65 C6.1
N$19
  Top 0.254: C35.2 R12.1
N$21
  Top 0.254: CF11.1 45.64,3.84 C7.2 42.89,4.84 C8.2 39.67,4.99 38.29,6.38 38.29,9.55 36.75,11.09 U$1.11
N$22
  Top 0.254: CF12.3 44.91,7.01 C9.2 44.35,6.99 C8.1 38.91,10.82 37.65,10.82 37.4,11.07 U$1.12
N$23
  Top 0.254: U$1.18 36.75,19.19 40.45,22.89 41.72,22.89 47.3,28.47 47.3,31.9 51.35,35.95 C11.2 C10.2 59.13,37.74 60.26,37.74 60.64,38.13 CF13.1
N$24
  Top 0.254: U$1.17 37.4,18.83 40.83,22.25 41.97,22.25 53.67,33.95 C11.1 55.07,33.95 56.07,34.95 60.15,34.95 C12.2
  Top 0.305: C12.2 60.78,34.32 CF14.3
N$25
  Top 0.254: U5.8 24.8,45.38 R13.2
N$27
  Top 0.254: CF15.1 55.05,21.23 54.15,20.33 C13.2 50.73,21.35 C14.2 44.37,21.35 38.05,15.03 U$1.13
N$30
  Top 0.254: CF14.1 66.54,34.32 D4.A D5.C | R8.1 68.81,34.6 D5.C | R19.2 69.08,34.95 D5.C
N$31
  Top 0.254: CF13.3 65.75,37.65 D4.C D5.A 69.09,36.86 R18.2
N$32
  Top 0.254: R14.1 52.74,4.94 D9.A D8.C 50.45,5.04 CF11.3
N$33
  Top 0.254: R15.2 52.91,6.67 D9.C | D9.C D8.A 49.3,6.94 CF12.1 | R6.1 52.73,7.03 D9.C
N$35
  Top 0.254: CF17.1 59.36,26.97 C16.2 57.24,27.06 C17.2 55.16,27.33 47.81,27.33 42.1,21.62 40.83,21.62 38.05,18.84 U$1.16
N$37
  Top 0.254: CF18.3 58.18,25.06 C17.1 54.8,25.06 C18.2 48.08,26.33 42.73,20.98 41.5,20.98 U$1.15
NRST  (via drill 0.6)
  Top 0.254: U$2.7 46.16,45.5 v46.54,45.11
  Bottom 0.254: v46.54,45.11 51.62,45.11 54.16,47.65 65.59,47.65 67.5,49.56 SV6.5
SCLK
  Top 0.254: CF2.3 30.9,25.04 U$1.27
SPEED
  Top 0.254: CF3.3 32.2,23 U$1.25
SWCLK  (via drill 0.6)
  Top 0.254: v50.35,49.56 49.91,50 U$2.37
  Bottom 0.254: v50.35,49.56 52.26,49.56 53.53,48.29 58.61,48.29 59.88,49.56 SV6.2
SWDIO
  Top 0.254: U$2.34 51.78,47.5 52.26,47.02 54.8,47.02 55.43,47.65 63.69,47.65 64.96,48.92 SV6.4
VDD  (via drill 0.6)
  Top 0.61: FERRYT.1 21.14,24.16 22.09,23.21 C23.1 22.09,19.39 v21.78,19.08 | IC1.2 14.89,5.74 C21.+ 16.34,5.94 IC3.3 18.6,13.34 v18.6,13.36
  Bottom 0.61: v21.78,19.08 21.78,16.54 v18.6,13.36
VOUT
  Top 0.254: R2.1 SV3.1
  Bottom 0.406: U2*.8 47.18,6.38 48.13,7.33 R4.2 SV2.1 66.23,12.73 68.77,15.27 SV4.1 70.04,15.9 70.04,24.16 72.58,26.7 75.75,26.7 | 75.75,26.7 SV5.1 | SV3.1 73.85,42.57 73.21,41.94 73.21,29.24 75.75,26.7

### Text on the board
tPlace: Piotr Markowski, waga CanBus | v0.3